# EAGLE board MOSFET_Board (EAGLE 9.2.1)
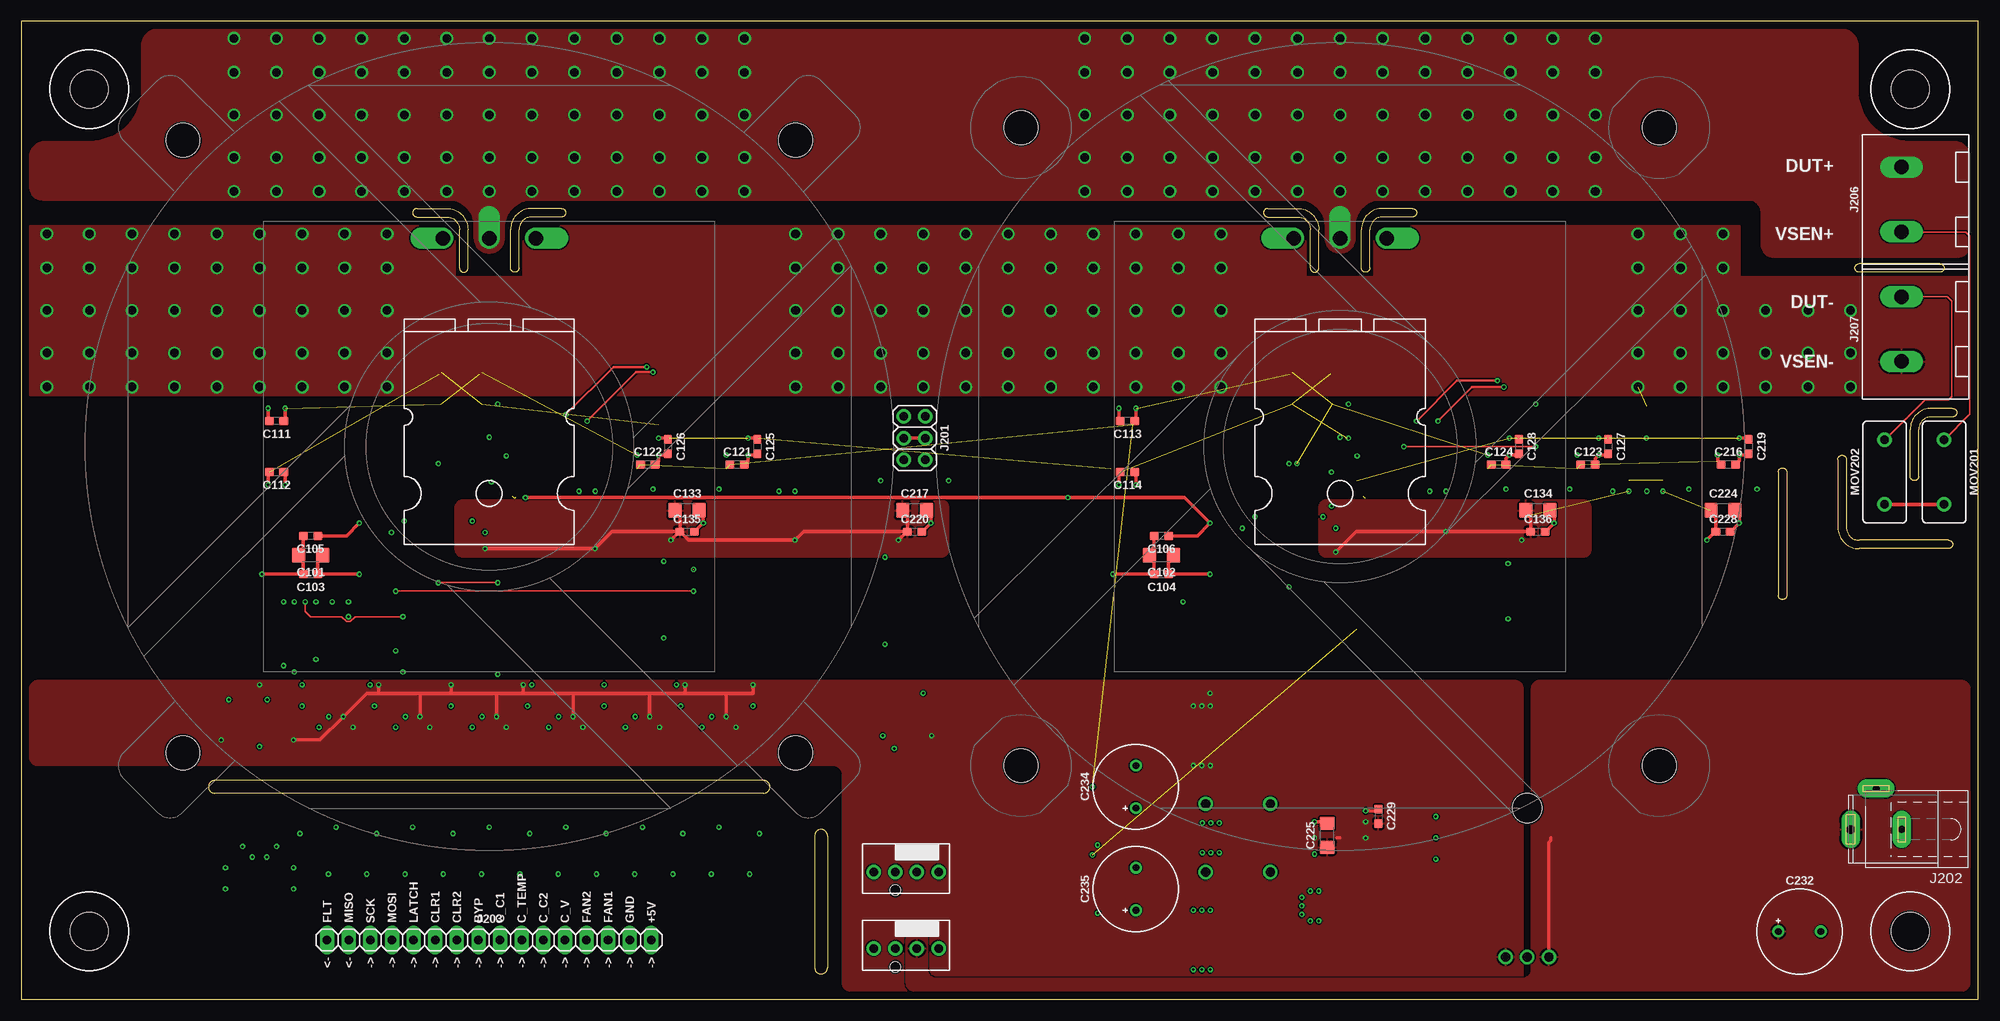
[diagram p3: board, top side]
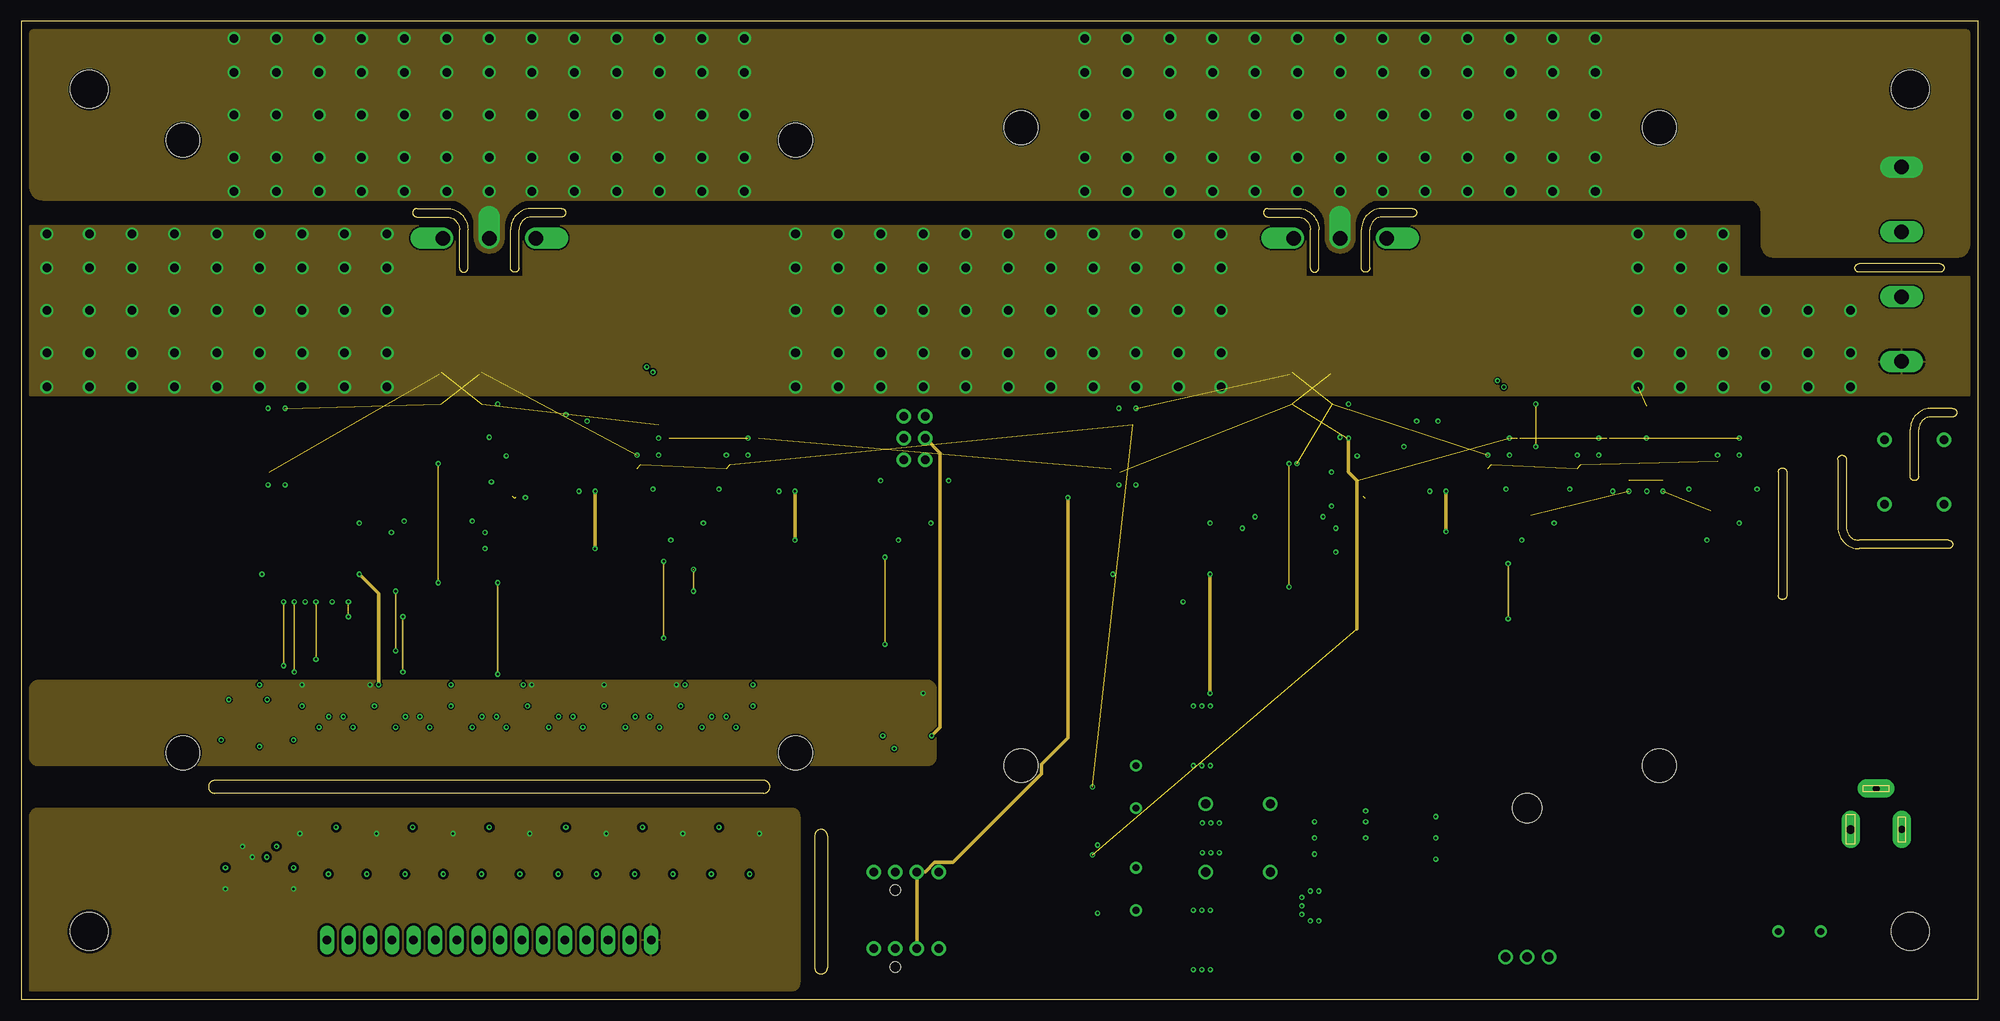
[diagram p4: board, inner layer Route2]
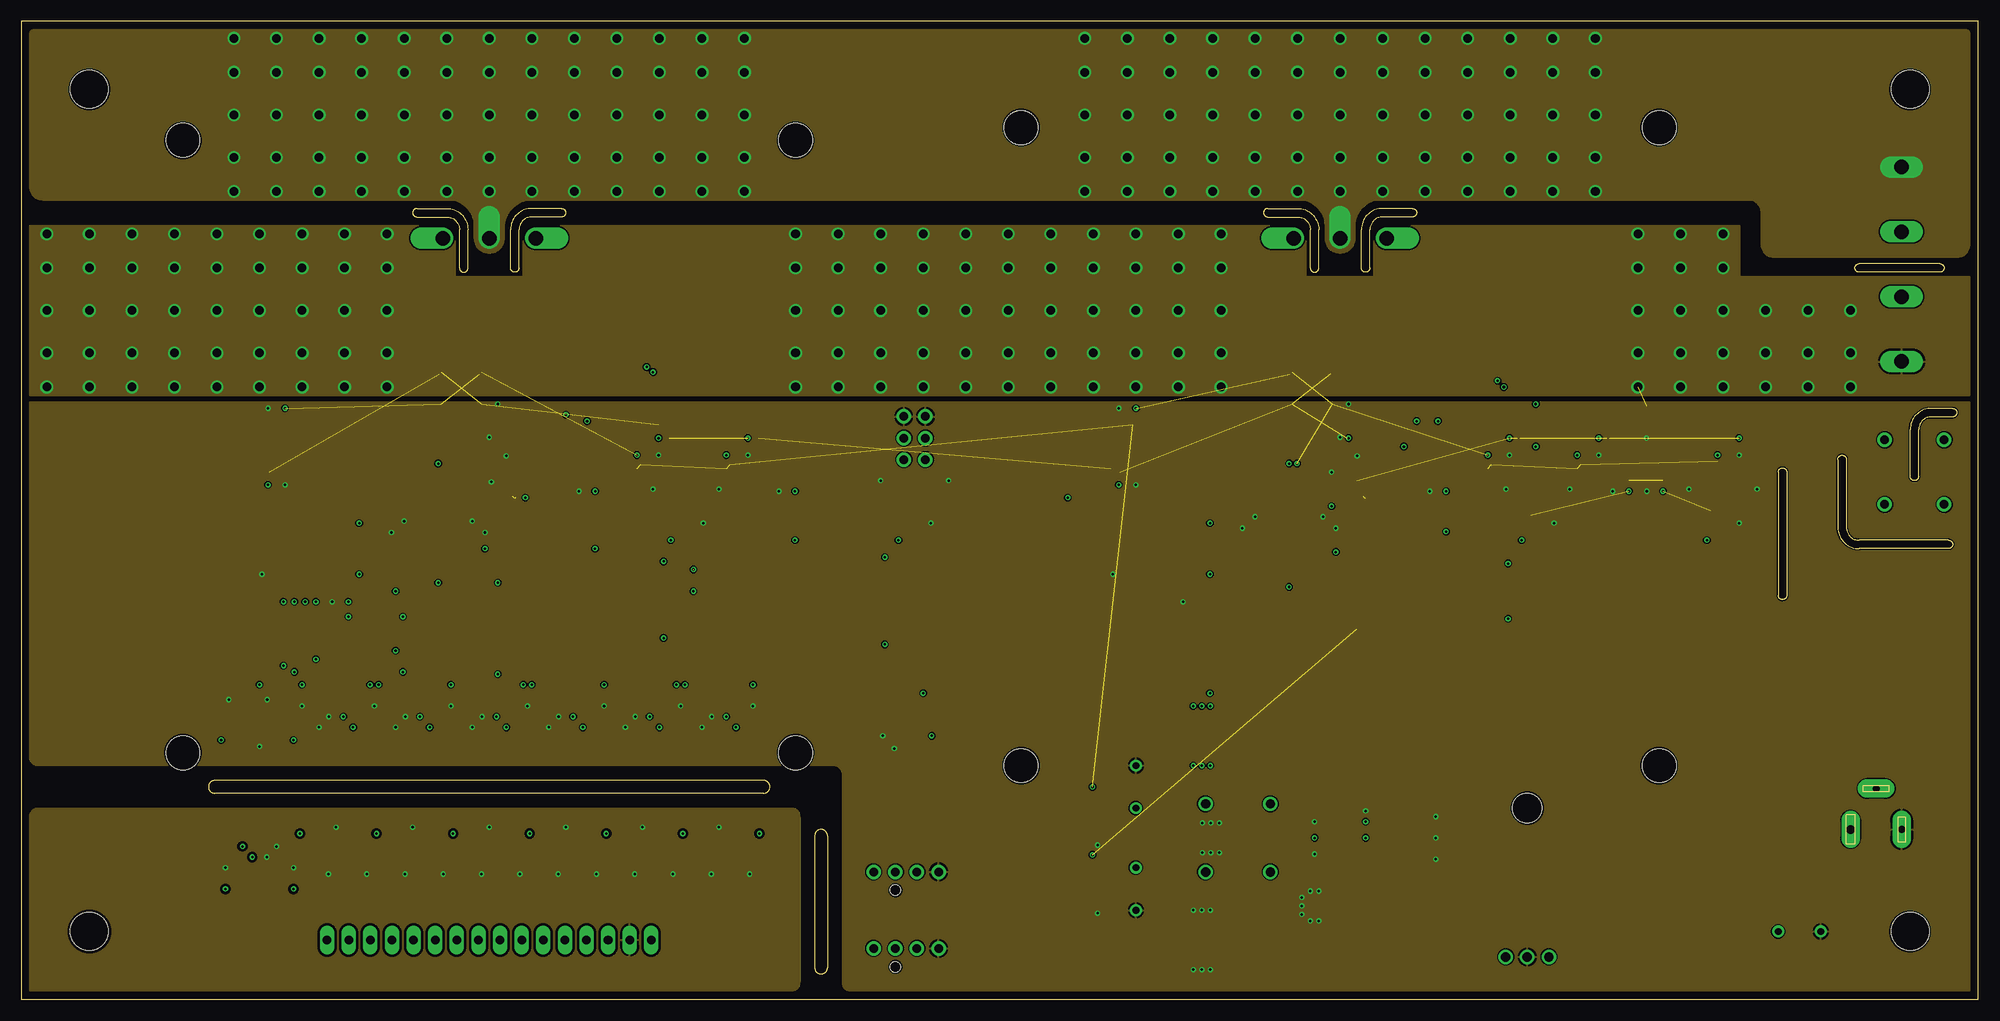
[diagram p5: board, inner layer Route15]
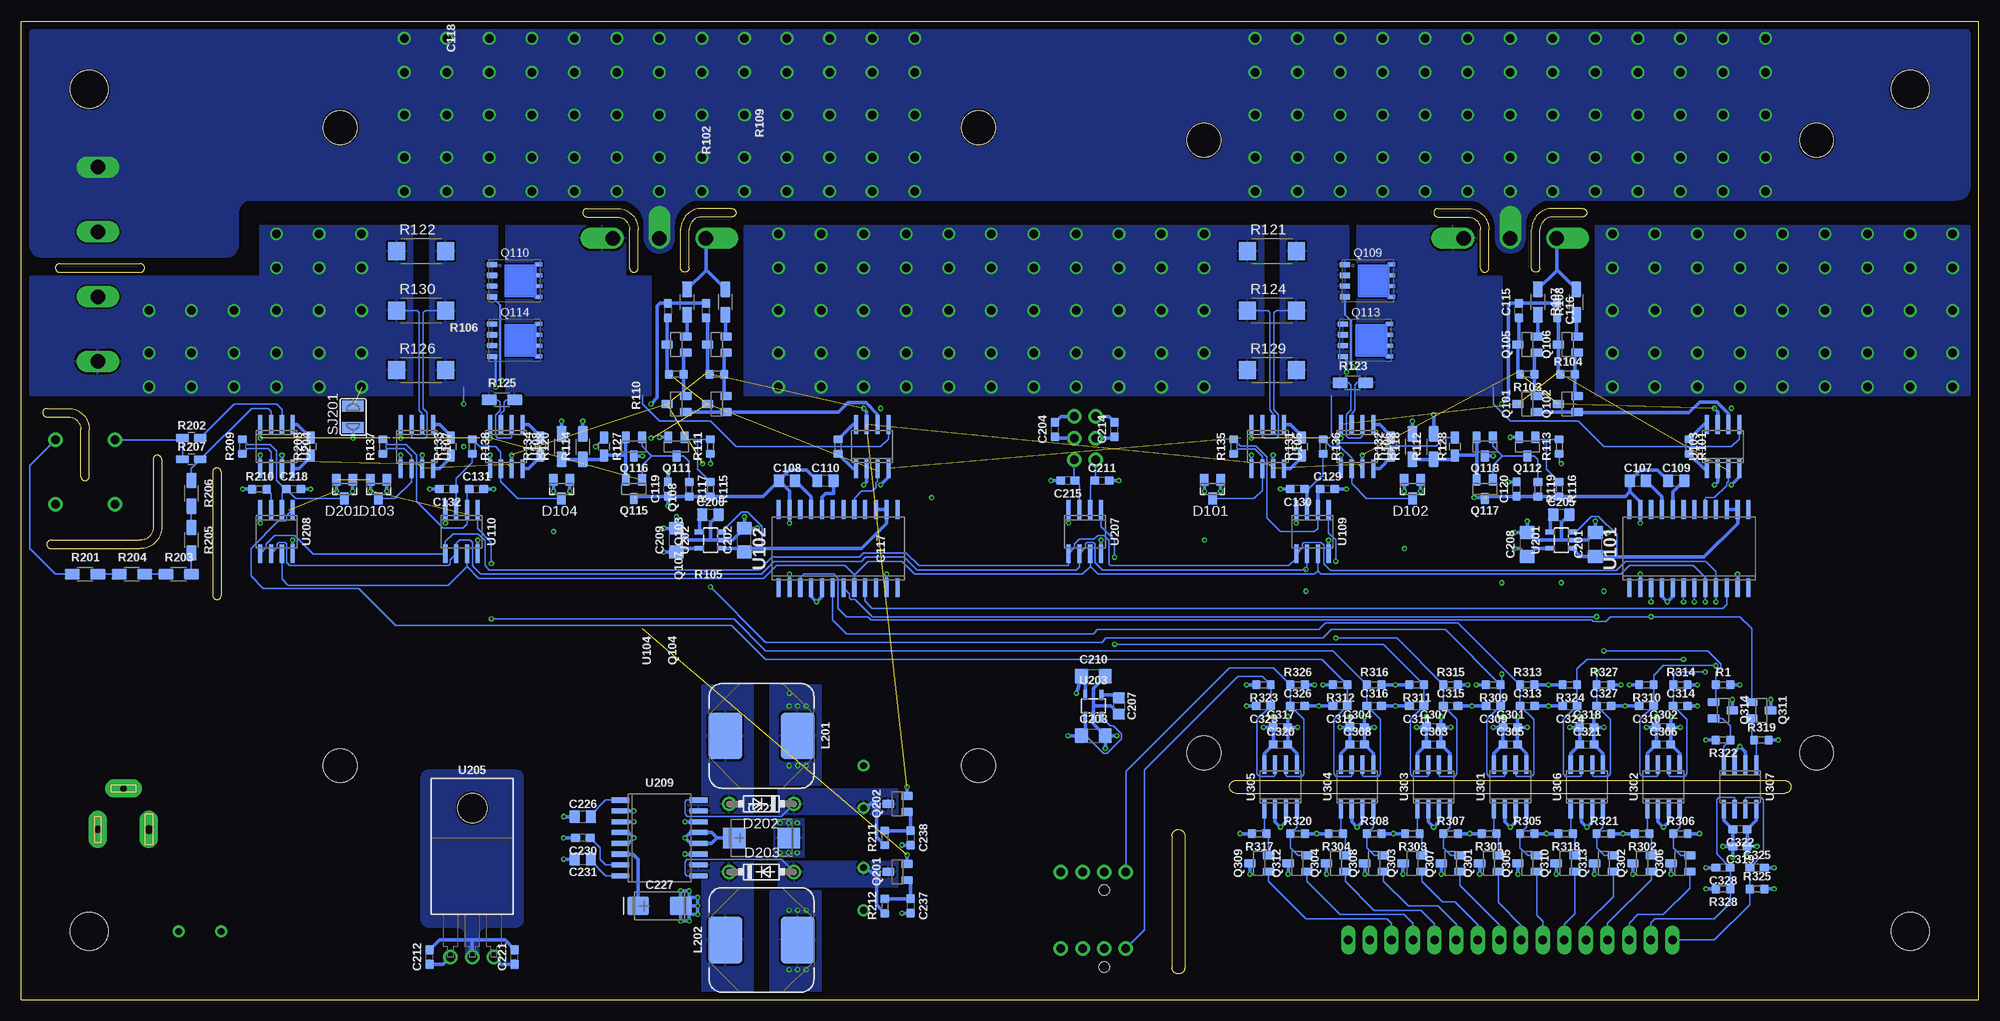
[diagram p6: board, bottom side, seen from below]

Size 230 x 115 mm. Coordinates in mm from the lower left corner, seen from the top.
Outline: 230,115 0,115 0,0 230,0 230,115
Outline: 225.5,85.5 216,85.5 arc-180 216,86.5 225.5,86.5 arc-180 225.5,85.5
Outline: 87.25,25.75 22.75,25.75 arc180 22.75,24.25 87.25,24.25 arc180 87.25,25.75
Outline: 158.5,86 158.5,90.5 arc-90 160,92 163.5,92 arc180 163.5,93 160,93 arc90 157.5,90.5 157.5,86 arc180 158.5,86
Outline: 151.5,86 151.5,90.5 arc90 150,92 146.5,92 arc-180 146.5,93 150,93 arc-90 152.5,90.5 152.5,86 arc-180 151.5,86
Outline: 58.5,86 58.5,90.5 arc-90 60,92 63.5,92 arc180 63.5,93 60,93 arc90 57.5,90.5 57.5,86 arc180 58.5,86
Outline: 51.5,86 51.5,90.5 arc90 50,92 46.5,92 arc-180 46.5,93 50,93 arc-90 52.5,90.5 52.5,86 arc-180 51.5,86
Outline: 94.75,19.25 94.75,3.75 arc-180 93.25,3.75 93.25,19.25 arc-180 94.75,19.25
Outline: 223,61.5 223,67 arc-90 224.5,68.5 227,68.5 arc180 227,69.5 224.5,69.5 arc90 222,67 222,61.5 arc180 223,61.5
Outline: 207.5,62 207.5,47.5 arc-180 206.5,47.5 206.5,62 arc-180 207.5,62
Outline: 226.5,54 216,54 arc-90 214.5,55.5 214.5,63.5 arc180 213.5,63.5 213.5,55.5 arc90 216,53 226.5,53 arc180 226.5,54
Copper layers (1+2*15+16): Top 0.035mm / dielectric 0.18mm / Route2 0.017mm / dielectric 1.12mm / Route15 0.017mm / dielectric 0.18mm / Bottom 0.035mm
Design rules "JLCPCB 4 layers 1oz *": minimum track width 6mil, minimum drill 0.3mm, track to track 6mil, track to pad 6mil, pad to pad 6mil, via to via 6mil, smd to smd 6mil, copper to edge 0.2mm, drill to drill 6mil, minimum pad ring 3mil, minimum via ring 3mil, stop-mask expansion 4mil, vias tented up to drill 0mil, thermal gap 10mil
Net classes: 0 default: drill 0.3 mm; 1 DUT+: drill 0.3 mm, clearance 1.905 mm to class 0; 2 DUT-: drill 0.3 mm, clearance 1.905 mm to class 1; 3 VSENSE+: drill 0.3 mm, clearance 1.905 mm to class 0, clearance 1.905 mm to class 2; 4 VSENSE-: drill 0.3 mm, clearance 1.905 mm to class 1, clearance 1.905 mm to class 3; 5 default_iso: drill 0.3 mm, clearance 1.905 mm to class 0, clearance 1.905 mm to class 1, clearance 1.905 mm to class 2, clearance 1.905 mm to class 3, clearance 1.905 mm to class 4
tRestrict: area 214,99 to 229.8,114.8; area 0.2,99 to 16,114.8

## Footprints (pad centres in the part's own frame; a part is rotated, then mirrored left to right if it is on the bottom)
CAPC3216 = smd 1.6 x 1.8: 1 -1.4,0; 2 1.4,0
CAPC1608 = smd 1.1 x 1: 1 -0.85,0; 2 0.85,0
CAPC2012 = smd 1.3 x 1.5: 1 -0.95,0; 2 0.95,0
CAPCP7343 = smd 2.6 x 2.4: + -3.2,0; - 3.2,0
CAPCP6032 = smd 2.6 x 2.2: + -2.5,0; - 2.5,0
CAPPRD500W60D1000H = drill 0.8 pad 1.4: + -2.5,0; - 2.5,0
SOT23 = smd 1 x 1.4: 1 -0.95,-1.1; 2 0.95,-1.1; 3 0,1.1
DO41-7.6 = drill 1.1 pad 1.7: A 3.81,0; C -3.81,0
D95263-001 = hole 4: -36,36; 36,36; 36,-36; -36,-36
E97378-001 = hole 4: -37.5,37.5; 37.5,37.5; 37.5,-37.5; -37.5,-37.5
HEAD_MALE_2X3 = drill 1 pad 1.7: 1 -2.54,-1.27; 2 -2.54,1.27; 3 0,-1.27; 4 0,1.27; 5 2.54,-1.27; 6 2.54,1.27
SPC4078 = drill 0.8 pad 2.184 long: 1 -3,0; 2 0,-4.8 | drill 1 pad 2.184 long: 3 3,0
HEAD_MALE_1X16 = drill 1 pad 1.7 long: 1 -19.05,0; 2 -16.51,0; 3 -13.97,0; 4 -11.43,0; 5 -8.89,0; 6 -6.35,0; 7 -3.81,0; 8 -1.27,0; 9 1.27,0; 10 3.81,0; 11 6.35,0; 12 8.89,0; 13 11.43,0; 14 13.97,0; 15 16.51,0; 16 19.05,0
MOLEX_47053-1000 = drill 1 pad 1.7: 1 3.81,0; 2 1.27,0; 3 -1.27,0; 4 -3.81,0 | hole 1.25: -1.27,-2.16
AMPHENOL-12-762_2 = drill 1.7 pad 2.4 long: 1 -3.81,0; 2 3.81,0
MSS1260 = smd 5.5 x 4: 1 0,4.25; 2 0,-4.25
DISK_9.5MM = drill 1 pad 1.7: 1 -3.8,0; 2 3.8,0
POWERPAK-SO-8 = smd 1.27 x 0.61: 1 -2.67,1.905; 2 -2.67,0.635; 3 -2.67,-0.635; 4 -2.67,-1.905 | smd 0.6 x 0.3: 5 2.795,1.905; 6 2.795,0.635; 7 2.795,-0.635; 8 2.795,-1.905
TO-264P-H-PADUP = drill 1.7 pad 2.4 offset: 1 -5.46,0; 2 0,0; 3 5.46,0
RESC1608 = smd 1 x 1.1: 1 -0.85,0; 2 0.85,0
RESC3216 = smd 1.8 x 1.2: 1 -1.499,0; 2 1.499,0
RESC6332 = smd 2 x 2.1: 1 -2.896,0; 2 2.896,0
RESC2012 = smd 1.5 x 1: 1 -1.052,0; 2 1.052,0
SJW = smd 1.27 x 2.54: 1 -1.27,0; 2 1.27,0
SO24W = smd 0.6 x 2.2: 1 -6.985,-4.6; 2 -5.715,-4.6; 3 -4.445,-4.6; 4 -3.175,-4.6; 5 -1.905,-4.6; 6 -0.635,-4.6; 7 0.635,-4.6; 8 1.905,-4.6; 9 3.175,-4.6; 10 4.445,-4.6; 11 5.715,-4.6; 12 6.985,-4.6; 13 6.985,4.6; 14 5.715,4.6; 15 4.445,4.6; 16 3.175,4.6; 17 1.905,4.6; 18 0.635,4.6; 19 -0.635,4.6; 20 -1.905,4.6; 21 -3.175,4.6; 22 -4.445,4.6; 23 -5.715,4.6; 24 -6.985,4.6
SO8 = smd 0.6 x 2.2: 1 -1.905,-2.6; 2 -0.635,-2.6; 3 0.635,-2.6; 4 1.905,-2.6; 5 1.905,2.6; 6 0.635,2.6; 7 -0.635,2.6; 8 -1.905,2.6
SOT23-5L = smd 0.55 x 1.2: 1 -0.95,-1.3; 2 0,-1.3; 3 0.95,-1.3; 4 0.95,1.3; 5 -0.95,1.3
TO-220AB-3-BR = drill 1.1 pad 1.7: 1 -2.54,0; 2 0,0; 3 2.54,0 | hole 3.5: 0,17.5
SO16W = smd 0.6 x 2.2: 1 -4.445,-4.6; 2 -3.175,-4.6; 3 -1.905,-4.6; 4 -0.635,-4.6; 5 0.635,-4.6; 6 1.905,-4.6; 7 3.175,-4.6; 8 4.445,-4.6; 9 4.445,4.6; 10 3.175,4.6; 11 1.905,4.6; 12 0.635,4.6; 13 -0.635,4.6; 14 -1.905,4.6; 15 -3.175,4.6; 16 -4.445,4.6
M4 = hole 4.5: 0,0

## Placement (x,y rotation side)
C101  4µ7  [CAPC3216]  34,52.25 180 top
C102  4µ7  [CAPC3216]  134,52.25 180 top
C103  100n  [CAPC1608]  34,50 180 top
C104  100n  [CAPC1608]  134,50 180 top
C105  100n  [CAPC1608]  34,54.5 180 top
C106  100n  [CAPC1608]  134,54.5 180 top
C107  10n  [CAPC2012]  40,61 0 bottom
C108  10n  [CAPC2012]  140,61 0 bottom
C109  10n  [CAPC2012]  35.5,61 0 bottom
C110  10n  [CAPC2012]  135.5,61 0 bottom
C111  100n  [CAPC1608]  30,68 180 top
C112  100n  [CAPC1608]  30,62 180 top
C113  100n  [CAPC1608]  130,68 180 top
C114  100n  [CAPC1608]  130,62 180 top
C115  470n  [CAPC1608]  54,81 90 bottom
C116  470n  [CAPC1608]  49.5,81 270 bottom
C117  470n  [CAPC1608]  149.5,81 90 bottom
C118  470n  [CAPC1608]  154,81 270 bottom
C119  100n  [CAPC1608]  154,60 90 bottom
C120  100n  [CAPC1608]  54.25,60 90 bottom
C121  100n  [CAPC1608]  84.14,62.91 0 top
C122  100n  [CAPC1608]  73.64,62.91 0 top
C123  100n  [CAPC1608]  184.13,62.91 0 top
C124  100n  [CAPC1608]  173.63,62.91 0 top
C125  100n  [CAPC1608]  86.5,65 270 top
C126  100n  [CAPC1608]  76,65 270 top
C127  100n  [CAPC1608]  186.5,65 270 top
C128  100n  [CAPC1608]  176,65 270 top
C129  470p  [CAPC1608]  76.5,60 0 bottom
C130  470p  [CAPC1608]  80,60 180 bottom
C131  470p  [CAPC1608]  176.5,60 0 bottom
C132  470p  [CAPC1608]  180,60 180 bottom
C133  4µ7  [CAPC3216]  78.25,57.5 0 top
C134  4µ7  [CAPC3216]  178.25,57.5 0 top
C135  100n  [CAPC1608]  78.25,55 0 top
C136  100n  [CAPC1608]  178.25,55 0 top
C201  4µ7  [CAPC3216]  45,53.5 90 bottom
C202  4µ7  [CAPC3216]  145,54 90 bottom
C203  4µ7  [CAPC3216]  104,31 0 bottom
C204  100n  [CAPC1608]  108.5,67 90 bottom
C205  10n  [CAPC2012]  49,57 0 bottom
C206  10n  [CAPC2012]  149,57 0 bottom
C207  10n  [CAPC2012]  101,34.5 270 bottom
C208  4µ7  [CAPC3216]  53,53.5 90 bottom
C209  4µ7  [CAPC3216]  153,54 90 bottom
C210  4µ7  [CAPC3216]  104,38 0 bottom
C211  470n  [CAPC1608]  103,61 0 bottom
C212  470n  [CAPC1608]  182,5 90 bottom
C214  100n  [CAPC1608]  101.5,67 90 bottom
C215  470n  [CAPC1608]  107,61 180 bottom
C216  100n  [CAPC1608]  200.63,62.91 0 top
C217  4µ7  [CAPC3216]  105,57.5 0 top
C218  470p  [CAPC1608]  198,60 0 bottom
C219  100n  [CAPC1608]  203,65 270 top
C220  100n  [CAPC1608]  105,55 0 top
C221  100n  [CAPC1608]  172,5 90 bottom
C223  47µ  [CAPCP7343]  143,19 0 bottom
C224  4µ7  [CAPC3216]  200,57.5 0 top
C225  4µ7  [CAPC3216]  153.5,19.29 90 top
C226  10n  [CAPC2012]  164,21.5 0 bottom
C227  10µ  [CAPCP6032]  155,11 0 bottom
C228  100n  [CAPC1608]  200,55 0 top
C229  100n  [CAPC1608]  159.5,21.54 270 top
C230  470n  [CAPC1608]  164,19 180 bottom
C231  10n  [CAPC2012]  164,16.5 180 bottom
C232  220µ  [CAPPRD500W60D1000H]  209,8 0 top
C234  220µ  [CAPPRD500W60D1000H]  131,25 90 top
C235  220µ  [CAPPRD500W60D1000H]  131,13 90 top
C237  470n  [CAPC1608]  125.5,11 270 bottom
C238  470n  [CAPC1608]  125.5,19 270 bottom
C301  100n  [CAPC1608]  55,32 0 bottom
C302  100n  [CAPC1608]  37,32 0 bottom
C303  100n  [CAPC1608]  64,30 0 bottom
C304  100n  [CAPC1608]  73,32 0 bottom
C305  10n  [CAPC1608]  55,30 0 bottom
C306  10n  [CAPC1608]  37,30 0 bottom
C307  10n  [CAPC1608]  64,32 0 bottom
C308  10n  [CAPC1608]  73,30 0 bottom
C309  15p  [CAPC1608]  57,34.5 180 bottom
C310  15p  [CAPC1608]  39,34.5 180 bottom
C311  15p  [CAPC1608]  66,34.5 180 bottom
C312  15p  [CAPC1608]  75,34.5 180 bottom
C313  15p  [CAPC1608]  53,34.5 0 bottom
C314  15p  [CAPC1608]  35,34.5 0 bottom
C315  15p  [CAPC1608]  62,34.5 0 bottom
C316  15p  [CAPC1608]  71,34.5 0 bottom
C317  100n  [CAPC1608]  82,32 0 bottom
C318  100n  [CAPC1608]  46,32 0 bottom
C319  100n  [CAPC1608]  28,18 180 bottom
C320  10n  [CAPC1608]  82,30 0 bottom
C321  10n  [CAPC1608]  46,30 0 bottom
C322  10n  [CAPC1608]  28,20 180 bottom
C323  15p  [CAPC1608]  84,34.5 180 bottom
C324  15p  [CAPC1608]  48,34.5 180 bottom
C325  15p  [CAPC1608]  26,15.5 0 bottom
C326  15p  [CAPC1608]  80,34.5 0 bottom
C327  15p  [CAPC1608]  44,34.5 0 bottom
C328  15p  [CAPC1608]  30,15.5 180 bottom
D101  BAT54S  [SOT23]  90,60 180 bottom
D102  BAT54S  [SOT23]  66.5,60 180 bottom
D103  BAT54S  [SOT23]  188,60 180 bottom
D104  BAT54S  [SOT23]  166.5,60 180 bottom
D201  BAT54S  [SOT23]  192,60 180 bottom
D202  1N5817-B  [DO41-7.6]  143,23 180 bottom
D203  1N5817-B  [DO41-7.6]  143,15 0 bottom
HS101  HEATSINK_LGA775  [D95263-001]  55,65 0 top
HS102  HEATSINK_LGA115X  [E97378-001]  155,65 270 top
J201  TEMP  [HEAD_MALE_2X3]  105,66 270 top
J202  +12V  [SPC4078]  218,20 180 top
J203  CTRL  [HEAD_MALE_1X16]  55,7 0 top
J204  FAN_MOLEX4PIN  [MOLEX_47053-1000]  104,6 0 top
J205  FAN_MOLEX4PIN  [MOLEX_47053-1000]  104,15 0 top
J206  DUT+  [AMPHENOL-12-762_2]  221,94.05 90 top
J207  DUT-  [AMPHENOL-12-762_2]  221,78.81 90 top
L201  100µ  [MSS1260]  143,31 270 bottom
L202  100µ  [MSS1260]  143,7 90 bottom
MOV201  416NR10D  [DISK_9.5MM]  226,62 270 top
MOV202  416NR10D  [DISK_9.5MM]  219,62 90 top
Q101  BC807  [SOT23]  53,70 90 bottom
Q102  BC817  [SOT23]  48.25,70 90 bottom
Q103  BC807  [SOT23]  148.25,70 90 bottom
Q104  BC817  [SOT23]  153,70 90 bottom
Q105  BC817  [SOT23]  53,77 90 bottom
Q106  BC807  [SOT23]  48.25,77 90 bottom
Q107  BC817  [SOT23]  148.25,77 90 bottom
Q108  BC807  [SOT23]  153,77 90 bottom
Q109  SIRC10DP  [POWERPAK-SO-8]  71.75,84.5 0 bottom
Q110  SIRC10DP  [POWERPAK-SO-8]  172,84.5 0 bottom
Q111  BC817  [SOT23]  153,65 180 bottom
Q112  BC817  [SOT23]  53,65 180 bottom
Q113  SIRC10DP  [POWERPAK-SO-8]  72,77.5 0 bottom
Q114  SIRC10DP  [POWERPAK-SO-8]  172,77.5 0 bottom
Q115  BC817  [SOT23]  158,60 180 bottom
Q116  BC807  [SOT23]  158,65 180 bottom
Q117  BC817  [SOT23]  58,60 180 bottom
Q118  BC807  [SOT23]  58,65 180 bottom
Q119  IXTK102N65X2  [TO-264P-H-PADUP]  55,89.5 180 top
Q120  IXTK102N65X2  [TO-264P-H-PADUP]  155,89.5 180 top
Q201  BC817  [SOT23]  127,15 90 bottom
Q202  BC817  [SOT23]  127,23 90 bottom
Q301  BC807  [SOT23]  57.5,16 90 bottom
Q302  BC807  [SOT23]  39.5,16 90 bottom
Q303  BC807  [SOT23]  66.5,16 90 bottom
Q304  BC807  [SOT23]  75.5,16 90 bottom
Q305  BC807  [SOT23]  53,16 90 bottom
Q306  BC807  [SOT23]  35,16 90 bottom
Q307  BC807  [SOT23]  62,16 90 bottom
Q308  BC807  [SOT23]  71,16 90 bottom
Q309  BC807  [SOT23]  84.5,16 90 bottom
Q310  BC807  [SOT23]  48.5,16 90 bottom
Q311  BC807  [SOT23]  25.5,34 270 bottom
Q312  BC807  [SOT23]  80,16 90 bottom
Q313  BC807  [SOT23]  44,16 90 bottom
Q314  BC807  [SOT23]  30,34 270 bottom
R1  1k  [RESC1608]  30,37 0 bottom
R101  49k3  [RESC1608]  34,65 270 bottom
R102  49k3  [RESC1608]  134,65 270 bottom
R103  5k  [RESC1608]  53,73.5 180 bottom
R104  5k  [RESC1608]  48.25,73.5 0 bottom
R105  5k  [RESC1608]  148.25,73.5 180 bottom
R106  5k  [RESC1608]  153,73.5 0 bottom
R107  2R  [RESC3216]  51.75,82 270 bottom
R108  2R  [RESC3216]  47.25,82 90 bottom
R109  2R  [RESC3216]  147.25,82 270 bottom
R110  2R  [RESC3216]  151.75,82 90 bottom
R111  1k  [RESC1608]  149,65 90 bottom
R112  2R  [RESC3216]  64,65 90 bottom
R113  1k  [RESC1608]  49.25,65 90 bottom
R114  2R  [RESC3216]  164,65 90 bottom
R115  100k  [RESC1608]  149,60 270 bottom
R116  100k  [RESC1608]  49.25,60 270 bottom
R117  1k  [RESC1608]  151.5,60 270 bottom
R118  2R  [RESC3216]  66.5,65 90 bottom
R119  1k  [RESC1608]  51.75,60 270 bottom
R120  2R  [RESC3216]  166.5,65 90 bottom
R121  0R01  [RESC6332]  83,88 0 bottom
R122  0R01  [RESC6332]  183,88 0 bottom
R123  2R  [RESC3216]  73.5,72.5 0 bottom
R124  0R01  [RESC6332]  83,81 0 bottom
R125  2R  [RESC3216]  173.5,70.5 0 bottom
R126  0R01  [RESC6332]  183,74 0 bottom
R127  2k15  [RESC2012]  161.5,65 270 bottom
R128  2k15  [RESC2012]  61.5,65 90 bottom
R129  0R01  [RESC6332]  83,74 0 bottom
R130  0R01  [RESC6332]  183,81 0 bottom
R131  2k15  [RESC2012]  79.5,65 90 bottom
R132  2k15  [RESC2012]  69,65 90 bottom
R133  2k15  [RESC2012]  179.5,65 90 bottom
R134  2k15  [RESC2012]  169,65 90 bottom
R135  100R  [RESC1608]  87.5,65 90 bottom
R136  100R  [RESC1608]  77,65 270 bottom
R137  100R  [RESC1608]  187.5,65 90 bottom
R138  100R  [RESC1608]  177,65 270 bottom
R201  2M  [RESC3216]  222.5,50 0 bottom
R202  2k15  [RESC2012]  210,66 0 bottom
R203  2M  [RESC3216]  211.5,50 0 bottom
R204  2M  [RESC3216]  217,50 0 bottom
R205  2M  [RESC3216]  210,54 270 bottom
R206  2M  [RESC3216]  210,59.5 270 bottom
R207  2k15  [RESC2012]  210,63.5 0 bottom
R208  2k15  [RESC2012]  196,65 90 bottom
R209  100R  [RESC1608]  204,65 90 bottom
R210  10k  [RESC1608]  202,60 0 bottom
R211  350R  [RESC1608]  128.5,19 90 bottom
R212  350R  [RESC1608]  128.5,11 90 bottom
R301  350R  [RESC1608]  57.5,19.5 180 bottom
R302  350R  [RESC1608]  39.5,19.5 180 bottom
R303  350R  [RESC1608]  66.5,19.5 180 bottom
R304  350R  [RESC1608]  75.5,19.5 180 bottom
R305  350R  [RESC1608]  53,19.5 0 bottom
R306  350R  [RESC1608]  35,19.5 0 bottom
R307  350R  [RESC1608]  62,19.5 0 bottom
R308  350R  [RESC1608]  71,19.5 0 bottom
R309  350R  [RESC1608]  57,37 180 bottom
R310  1k  [RESC1608]  39,37 180 bottom
R311  1k  [RESC1608]  66,37 180 bottom
R312  1k  [RESC1608]  75,37 180 bottom
R313  350R  [RESC1608]  53,37 0 bottom
R314  1k  [RESC1608]  35,37 0 bottom
R315  1k  [RESC1608]  62,37 0 bottom
R316  1k  [RESC1608]  71,37 0 bottom
R317  350R  [RESC1608]  84.5,19.5 180 bottom
R318  350R  [RESC1608]  48.5,19.5 180 bottom
R319  350R  [RESC1608]  25.5,30.5 0 bottom
R320  350R  [RESC1608]  80,19.5 0 bottom
R321  350R  [RESC1608]  44,19.5 0 bottom
R322  350R  [RESC1608]  30,30.5 180 bottom
R323  350R  [RESC1608]  84,37 180 bottom
R324  350R  [RESC1608]  48,37 180 bottom
R325  350R  [RESC1608]  26,13 0 bottom
R326  350R  [RESC1608]  80,37 0 bottom
R327  350R  [RESC1608]  44,37 0 bottom
R328  350R  [RESC1608]  30,13 180 bottom
SJ201  DUT_GND  [SJW]  191,68.5 90 bottom
U101  AD420  [SO24W]  34,53 0 bottom
U102  AD420  [SO24W]  134,53 0 bottom
U103  AD620  [SO8]  30,65 0 bottom
U104  AD620  [SO8]  130,65 0 bottom
U105  AD620  [SO8]  83.5,65 180 bottom
U106  AD620  [SO8]  73,65 180 bottom
U107  AD620  [SO8]  183.5,65 180 bottom
U108  AD620  [SO8]  173,65 180 bottom
U109  LTC1865L  [SO8]  78.25,55 180 bottom
U110  LTC1865L  [SO8]  178.25,55 180 bottom
U201  LP2985-3.1  [SOT23-5L]  49,54 90 bottom
U202  LP2985-3.1  [SOT23-5L]  149,54 90 bottom
U203  LP2985-3.1  [SOT23-5L]  104,34.5 0 bottom
U204  AD620  [SO8]  200,65 180 bottom
U205  78L05_TO-220AB-3-BR  [TO-220AB-3-BR]  177,5 0 bottom
U207  LTC1865L  [SO8]  105,55 180 bottom
U208  LTC1865L  [SO8]  200,55 180 bottom
U209  MAX743  [SO16W]  155,19 270 bottom
U301  HCPL-063N  [SO8]  55,25 0 bottom
U302  HCPL-063N  [SO8]  37,25 0 bottom
U303  HCPL-063N  [SO8]  64,25 0 bottom
U304  HCPL-063N  [SO8]  73,25 0 bottom
U305  HCPL-063N  [SO8]  82,25 0 bottom
U306  HCPL-063N  [SO8]  46,25 0 bottom
U307  HCPL-063N  [SO8]  28,25 180 bottom
U$6  [M4]  8,107 0 top
U$7  [M4]  222,107 0 top
U$8  [M4]  222,8 0 top
U$9  [M4]  8,8 0 top

## Tracks (layer width: path | path; a pad name or v marks a point on that pad's centre or on a via)
+3V3  (via drill 0.3 pad 0.6)
  Bottom 0.406: R315.2 v60,37 | R312.2 v77,37 | R316.2 v68.5,37 R311.2 | R314.2 v33,37 | v41,37 R310.2 | v106,36 C210.1 104.95,37.55 U203.5
  pour Route2: 2,27.5 arc-90 1,28.5 1,36.5 arc-90 2,37.5 106.5,37.5 arc-90 107.5,36.5 107.5,28.5 arc-90 106.5,27.5
+3V_1  (via drill 0.3 pad 0.6)
  Top 0.406: C220.1 104.09,55 v103.09,54 | C217.1 104.15,56.95 C220.1 | C133.1 77.4,56.95 C135.1 | v54.5,53 v67.44,53 69.44,55 C135.1 | C135.1 78.4,54 v90.94,54 91.94,55 C220.1 | v76.34,54 77.34,55 C135.1
  Route2 0.406: v67.45,59.75 67.45,53.02 v67.44,53 | v90.94,59.75 v90.94,54
  Bottom 0.406: U201.5 52.05,53.05 C208.1 53.9,53 v54.5,53 | v103.09,54 U207.8 | v76.34,54 U109.8 | D102.2 v67.45,59.75 | D101.2 90.95,59.77 v90.94,59.75
  pour Top: 51,53 arc90 52,52 108,52 arc90 109,53 109,57.75 arc90 108,58.75 52,58.75 arc90 51,57.75
+3V_2  (via drill 0.3 pad 0.6)  (3 unrouted)
  Top 0.406: C136.1 177.34,55 | C134.1 177.4,56.95 C136.1 | v198.11,54 199.11,55 C228.1 199.15,56.95 C224.1 | C136.1 v167.45,55 156.9,55 v154.5,52.6
  Route2 0.406: v167.45,59.75 v167.45,55
  Bottom 0.406: v176.34,54 U110.8 | U208.8 198.09,53.99 v198.11,54 | U202.5 152.55,53.05 C209.1 v154.5,52.6 | D104.2 v167.45,59.75 | D103.2 v188.95,59.75 | D201.2 v192.95,59.75
  pour Top: 152.5,53 arc90 153.5,52 183.5,52 arc90 184.5,53 184.5,57.75 arc90 183.5,58.75 153.5,58.75 arc90 152.5,57.75
+5V  (via drill 0.3 pad 0.6)
  Top 0.406: v39.72,50 C103.1 34.85,51.7 C101.1 | 154.61,19 155,19 | v139.72,50 C104.1 134.85,51.7 C102.1 | 42,36 46.85,36 | 46.85,36 50.5,36 | 50.5,36 55.85,36 | 55.85,36 59,36 | 59,36 64.85,36 | 64.85,36 73.85,36 | 73.85,36 78,36 | 78,36 82.85,36 | 82.85,36 86,36 v86,37 | v78,37 78,36 | v82.85,33.25 82.85,36 | v73.85,33.25 73.85,36 | v64.85,33.25 64.85,36 | v59,37 59,36 | v55.85,33.25 55.85,36 | v50.5,37 50.5,36 | v46.85,33.25 46.85,36 | 42,36 40.6,36 v37.85,33.25 35.1,30.5 v32,30.5 | v42,37 42,36 | J201.4 J201.3
  Route2 0.406: v107,31 108,32 108,64.27 J201.4 | v42,37 42,47.72 v39.72,50 | v139.72,50 v139.72,36
  Bottom 0.203: U203.3 102,32.15 101.62,32.15 100.7,31.23 100.7,30.62 102.37,28.95 102.83,28.95 104.88,31 C203.1
  Bottom 0.406: U301.8 56.91,28.95 C305.1 C301.1 | C301.1 v57,32 | v55.85,33.25 C301.1 | R324.2 v50.5,37 R313.2 | R309.2 v59,37 | v86,37 R323.2 | R326.2 v78,37 | v42,37 R327.2 | C302.1 v37.85,33.25 | C302.1 v39,32 | U302.8 38.91,28.95 C306.1 C302.1 | U306.8 47.91,28.95 C321.1 C318.1 | C318.1 v48,32 | C318.1 v46.85,33.25 | U303.8 65.91,28.95 C303.1 C307.1 | C307.1 v66,32 | C307.1 v64.85,33.25 | C304.1 v75,32 | U304.8 74.91,28.95 C308.1 C304.1 | U305.8 83.91,28.95 C320.1 C317.1 | C317.1 v84,32 | C317.1 v82.85,33.25 | R322.2 v32,30.5 | C214.1 101.65,66 J201.3 | C204.1 108.35,66 J201.4 | v39.72,50 U101.2 | U209.3 v158,20.91 | U209.4 158.63,19.63 v158,19 158.63,18.37 U209.5 | C304.1 v73.85,33.25 | v139.72,50 U102.2 | U203.1 104.95,31.45 C203.1 v107,31 | 148.25,19 148.88,19.63 U209.13 151.37,19.63 v152,19 151.37,18.37 U209.12 148.88,18.37 148.25,19 | C223.+ 148.25,19 | C221.1 173.61,4.15 U205.3 | R319.2 v23.5,30.5 | R1.2 v28,37
  other vias: 138.75,34.5 139.75,34.5 137.75,34.5 137.75,27.5 138.75,27.5 139.75,27.5
  pour Bottom: 142,37 142,25.25 136,25.25 136,37
  pour Top (rank 2): 2,27.5 arc-90 1,28.5 1,36.5 arc-90 2,37.5 175.5,37.5 arc-90 176.5,36.5 176.5,2 arc-90 175.5,1 97.5,1 arc-90 96.5,2 96.5,26.5 arc90 95.5,27.5
+5V_I  (via drill 0.3 pad 0.6)
  Bottom 0.406: R306.2 v32.75,19.5 | R302.2 v41.75,19.5 R321.2 | R318.2 v50.75,19.5 R305.2 | R301.2 v59.75,19.5 R307.2 | R303.2 v68.75,19.5 R308.2 | R304.2 v77.75,19.5 R320.2 | R317.2 v86.75,19.5 | U307.8 26.09,21.05 C322.1 C319.1 | v26,18 C319.1 | C319.1 v27.15,16.75 | R325.2 v24,13 | R328.2 v32,13
  pour Route2 (isolate 0.305): 1,1 1,21.5 arc-90 2,22.5 90.5,22.5 arc-90 91.5,21.5 91.5,2 arc-90 90.5,1
+12V  (via drill 0.3 pad 0.6)  (3 unrouted)
  Top 0.406: C105.1 38.22,54.5 v39.72,56 | U205.1 179.54,18.49 179.74,18.69 179.74,19.02 | C106.1 138.22,54.5 v139.72,56 136.72,59 v123,59 v59.25,59
  Route2 0.406: v123,59 123,30.75 119.9,27.65 119.9,26.51 109.5,16.11 107.35,16.11 106.25,15 J205.2 | 105.27,13.02 J205.2 | J204.2 J205.2
  Bottom 0.406: 57.75,59.15 C120.1 R119.2 R116.2 41.5,59.15 40.95,59.7 | 40.95,59.7 C107.1 39.7,62.25 37.7,62.25 C109.1 | 40.95,59.7 39.72,58.47 U101.23 v39.72,56 | v139.72,56 U102.23 139.72,59.77 C108.1 | C110.1 137.7,62.25 139.7,62.25 C108.1 | 157.75,59.15 C119.1 154,59 | 154,59 v154,58 | C108.1 142.8,59.15 R115.2 R117.2 153.85,59.15 154,59 | v59.25,59 58.1,59 | C212.1 180.39,4.15 U205.1
  pour Top: 177.5,3.5 177.5,36.5 arc-90 178.5,37.5 228,37.5 arc-90 229,36.5 229,2 arc-90 228,1 105,1 arc-90 104,2 104,7 arc-90 105,8 105.5,8 arc-90 106.5,7 106.5,3.5 arc90 107.5,2.5 176.5,2.5 arc90
+15V  (via drill 0.3 pad 0.6)  (16 unrouted)
  Top 0.406: C216.1 199.37,63.33 v199.37,64 | C122.1 72.69,63 | C124.1 172.69,63 | C111.1 31,68.15 v31,69.5 | C113.1 131,68.15 v131,69.5
  Bottom 0.406: v182.87,64 U107.7 | v199.37,64 U204.7 | v82.86,64 U105.7 | Q202.2 v125.9,25 | v172.37,64 U108.7 | v72.37,64 U106.7 | C115.1 54,77.1 Q105.3 54.1,73.75 R103.2 | C117.1 149.35,80 Q107.3 149.35,73.75 R105.2 | U103.7 30.64,69.14 v31,69.5 | U104.7 130.63,69.14 v131,69.5
  other vias: 149.95,63
-15V  (via drill 0.3 pad 0.6)  (14 unrouted)
  Top 0.406: 186.35,66 C127.1 186.65,66 | 175,66 v174.91,66 | 175.85,66 C128.1 176.15,66 | C219.1 202.85,66 v201.91,66 | v74.91,66 75.85,66 C126.1 76.15,66 | v85.41,66 86.35,66 C125.1 86.65,66 | v156,66 155.83,66 | C112.2 29,61.85 v29,60.5 | v129,60.5 129,61.85 C114.2
  Route2 0.406: 157,43.57 157,61 156,62 v156,66
  Bottom 0.406: U107.4 v185.41,66 | U108.4 v174.91,66 | U204.4 v201.91,66 | U106.4 v74.91,66 | U105.4 v85.41,66 | Q201.2 v125.9,17 | C116.2 49.35,80 Q106.3 49.35,73.75 R104.1 | C118.2 154.1,80.05 Q108.3 154.1,73.75 R106.1 | v29,60.5 28.09,61.41 U103.4 | U104.4 128.09,61.41 v129,60.5
BPY1G1  (via drill 0.3 pad 0.6)
  Top 0.305: v73.5,74.36 69.6,74.36 v64,68.75
  Bottom 0.305: Q109.4 74.42,80.49 73.73,79.8 73.73,74.59 v73.5,74.36
  Bottom 0.406: v64,68.75 R112.2
BYP  (via drill 0.3 pad 0.6)
  Top 0.203: v49,49 v56,49
  Route2 0.203: v149,63 v149,48.5 | v49,63 v49,49 | v56,49 v56,38.25
  Bottom 0.203: U301.7 55.63,26.37 55.75,26.25 57.5,26.25 57.75,26.5 57.75,32.9 C309.1 R309.1 | R111.1 v149,63 | v149,48.5 142.5,42 103,42 102.5,42.5 77,42.5 76,43.5 62.65,43.5 R309.1 | R113.1 49.25,63.25 v49,63 | v56,38.25 56,37.15 R309.1
BYP1
  Bottom 0.406: R118.1 R112.1 61.95,63.5 R128.1 61.45,64 58.95,64 | Q118.2 58.95,64 | 58.95,64 Q117.2
BYP1G2  (via drill 0.3 pad 0.6)
  Top 0.305: v74.25,73.75 72.25,73.75 v66.5,68
  Bottom 0.305: Q113.4 74.25,75.17 v74.25,73.75
  Bottom 0.406: v66.5,68 R118.2
BYP2
  Bottom 0.406: 158.95,64 Q115.2 | Q116.2 158.95,64 | 158.95,64 161.45,64 R127.2 161.95,63.5 R114.1 R120.1
BYP2G1  (via drill 0.3 pad 0.6)
  Top 0.305: v173.5,72.75 168.75,72.75 v164,68
  Bottom 0.305: Q110.4 173.73,81.66 173.73,72.98 v173.5,72.75
  Bottom 0.406: v164,68 R114.2
BYP2G2  (via drill 0.3 pad 0.6)
  Top 0.305: v174.25,72 170.5,72 v166.5,68
  Bottom 0.305: Q114.4 174.25,75.17 v174.25,72
  Bottom 0.406: v166.5,68 R120.2
BYP_I
  Bottom 0.203: J203.8 53.73,8.73 56.4,11.4 Q301.1
CLR_DAC1  (via drill 0.3 pad 0.6)
  Route2 0.203: v34.64,40 34.64,40.36 v34.64,46.75
  Bottom 0.203: U306.7 46.63,26.37 46.75,26.25 48.5,26.25 48.75,26.5 48.75,32.9 C324.1 R324.1 47.15,38.85 46,40 v34.64,40 | U101.6 v34.64,46.75
CLR_DAC1_I
  Bottom 0.203: J203.6 48.65,8.85 47.4,10.1 Q310.1
CLR_DAC2
  Bottom 0.203: U301.6 54.37,26.37 54.25,26.25 52.5,26.25 52.25,26.5 52.25,32.9 C313.1 R313.1 61.14,44.29 76.71,44.29 77.5,43.5 103.5,43.5 104,43 133,43 134.63,44.64 U102.6
CLR_DAC2_I
  Bottom 0.203: J203.7 51.19,9.19 51.9,9.9 Q305.1
CONV_C1  (via drill 0.3 pad 0.6)
  Route2 0.203: v75.5,51.5 v75.5,42.5
  Bottom 0.203: U303.6 63.37,26.37 63.25,26.25 61.5,26.25 61.25,26.5 61.25,32.9 C315.1 R315.1 68.35,42.5 v75.5,42.5 | U109.1 76.34,54.84 75.5,54 v75.5,51.5
CONV_C1_I
  Bottom 0.203: J203.9 56.27,8.77 60.9,13.4 Q307.1
CONV_C2  (via drill 0.3 pad 0.6)
  Route2 0.203: v174.75,51.25 v174.75,44.75
  Bottom 0.203: U304.6 72.37,26.37 72.25,26.25 70.5,26.25 70.25,26.5 70.25,32.9 C316.1 R316.1 75.85,41 142.5,41 146.25,44.75 v174.75,44.75 | U110.1 176.34,55.34 174.75,53.75 v174.75,51.25
CONV_C2_I
  Bottom 0.203: J203.11 61.35,8.85 63.5,11 67,11 69.9,13.9 Q308.1
CONV_TEMP  (via drill 0.3 pad 0.6)
  Route2 0.203: v101.5,52 v101.5,41.75
  Bottom 0.203: U303.7 64.63,26.37 64.75,26.25 66.5,26.25 66.75,26.5 66.75,32.9 C311.1 R311.1 69.9,41.75 v101.5,41.75 | U207.1 103.09,55.59 101.5,54 v101.5,52
CONV_TEMP_I
  Bottom 0.203: J203.10 58.81,8.81 61.5,11.5 63,11.5 65.4,13.9 Q303.1
CONV_V
  Bottom 0.203: U304.7 73.64,26.37 73.75,26.25 75.5,26.25 75.75,26.5 75.75,32.9 C312.1 R312.1 77.15,40 142.5,40 146.5,44 186,44 190.33,48.34 201.56,48.34 203,49.77 203,53.03 199.78,56.25 199,56.25 198.81,56.43 198.81,56.88 U208.1
CONV_V_I
  Bottom 0.203: J203.12 63.89,8.89 65.5,10.5 71,10.5 74.4,13.9 Q304.1
CSEN_H1
  Bottom 0.203: U106.2 72.37,66.25 72.62,66 74.02,66 74.27,66.25 74.27,68.77 73.75,69.29 73.75,72.25 74,72.5 R123.1 | U105.3 84.14,66.25 83.89,66 82.48,66 82.23,66.25 82.23,68.77 82.75,69.29 82.75,80.75 82.5,81 R124.2 | R128.2 62.66,66.05 63.66,65.05 69.55,65.05 69.94,65.45 75.13,65.45 75.84,66.16 76,66.31 76,71
  pour Bottom: 74,71 82,71 82,91 74,91
CSEN_H2  (via drill 0.3 pad 0.6)
  Top 0.203: v178,65 v162.5,65
  Route2 0.203: v178,70 v178,65
  Bottom 0.203: R125.1 174,70.5 173.75,70.25 173.75,69.25 174.27,68.73 174.27,66.27 174,66 172.5,66 172.37,66.14 U108.2 | R130.2 182.5,81 182.75,80.75 182.75,69.5 182.27,69.02 182.27,66.23 182.5,66 184,66 184.13,66.14 U107.3 | R127.1 161.5,66 v162.5,65 | v178,70 178,72
  pour Bottom: 174,71 182,71 182,91 174,91
CSEN_L1
  Bottom 0.203: U106.3 73.64,68.89 73.25,69.27 73.25,72.25 73,72.5 R123.2 | U103.5 28.09,65.91 29,65 44,65 47,68 55,68 57,70 57,72
  pour Bottom: 73,71 56,71 56,85 59,85 59,91 73,91
CSEN_L2
  Bottom 0.203: R125.2 173,70.5 173.25,70.25 173.25,69.25 173.63,68.86 U108.3 | U104.5 128.09,65.91 129,65 146,65 149,68 155,68 157,70 157,71
  pour Bottom: 173,71 156,71 156,85 159,85 159,91 173,91
DUT+  (via drill 1 pad 1)
  other vias: 30,104 30,109 30,99 30,113 30,95 35,104 35,109 35,99 35,113 35,95 40,104 40,109 40,99 40,113 40,95 45,104 45,109 45,99 45,113 45,95 50,104 50,109 50,99 50,113 50,95 55,104 55,109 55,99 55,113 55,95 25,104 25,109 25,99 25,113 25,95 60,104 60,109 60,99 60,113 60,95 65,104 65,109 65,99 65,113 65,95 70,104 70,109 70,99 70,113 70,95 75,104 75,109 75,99 75,113 75,95 80,104 80,109 80,99 80,113 80,95 85,104 85,109 85,99 85,113 85,95 130,104 130,109 130,99 130,113 130,95 135,104 135,109 135,99 135,113 135,95 140,104 140,109 140,99 140,113 140,95 145,104 145,109 145,99 145,113 145,95 150,104 150,109 150,99 150,113 150,95 155,104 155,109 155,99 155,113 155,95 125,104 125,109 125,99 125,113 125,95 160,104 160,109 160,99 160,113 160,95 165,104 165,109 165,99 165,113 165,95 170,104 170,109 170,99 170,113 170,95 175,104 175,109 175,99 175,113 175,95 180,104 180,109 180,99 180,113 180,95 185,104 185,109 185,99 185,113 185,95
  pour Top (no thermals): 53.25,91 53.25,89.5 arc180 56.75,89.5 56.75,90.75 arc-90 60,94 150.25,94 arc-90 153.25,91 153.25,89.5 arc90 155,87.75 arc90 156.75,89.5 156.75,91 arc-90 159.75,94 203,94 arc-90 204.5,92.5 204.5,88.75 arc90 206,87.25 227.5,87.25 arc90 229,88.75 229,113.5 arc90 228.5,114 1.5,114 arc90 1,113.5 1,95.5 arc90 2.5,94 50.25,94 arc-90
  pour Route2 (no thermals): 53.25,91 53.25,89.5 arc180 56.75,89.5 56.75,90.75 arc-90 60,94 150.25,94 arc-90 153.25,91 153.25,89.5 arc90 155,87.75 arc90 156.75,89.5 156.75,91 arc-90 159.75,94 203,94 arc-90 204.5,92.5 204.5,88.75 arc90 206,87.25 227.5,87.25 arc90 229,88.75 229,113.5 arc90 228.5,114 1.5,114 arc90 1,113.5 1,95.5 arc90 2.5,94 50.25,94 arc-90
  pour Route15 (no thermals): 53.25,91 53.25,89.5 arc180 56.75,89.5 56.75,90.75 arc-90 60,94 150.25,94 arc-90 153.25,91 153.25,89.5 arc90 155,87.75 arc90 156.75,89.5 156.75,91 arc-90 159.75,94 203,94 arc-90 204.5,92.5 204.5,88.75 arc90 206,87.25 227.5,87.25 arc90 229,88.75 229,113.5 arc90 228.5,114 1.5,114 arc90 1,113.5 1,95.5 arc90 2.5,94 50.25,94 arc-90
  pour Bottom (no thermals): 53.25,91 53.25,89.5 arc180 56.75,89.5 56.75,90.75 arc-90 60,94 150.25,94 arc-90 153.25,91 153.25,89.5 arc90 155,87.75 arc90 156.75,89.5 156.75,91 arc-90 159.75,94 203,94 arc-90 204.5,92.5 204.5,88.75 arc90 206,87.25 227.5,87.25 arc90 229,88.75 229,113.5 arc90 228.5,114 1.5,114 arc90 1,113.5 1,95.5 arc90 2.5,94 50.25,94 arc-90
DUT-  (via drill 1 pad 1)  (1 unrouted)
  Bottom 0.203: U105.2 82.86,68.89 83.25,69.27 83.25,80.75 83.5,81 R124.1 | R130.1 183.5,81 183.25,80.75 183.25,69.25 182.87,68.86 U107.2
  other vias: 91,81 91,86 91,76 91,90 91,72 96,81 96,86 96,76 96,90 96,72 101,81 101,86 101,76 101,90 101,72 106,81 106,86 106,76 106,90 106,72 111,81 111,86 111,76 111,90 111,72 116,81 116,86 116,76 116,90 116,72 121,81 121,86 121,76 121,90 121,72 126,81 126,86 126,76 126,90 126,72 131,81 131,86 131,76 131,90 131,72 136,81 136,86 136,76 136,90 136,72 141,81 141,86 141,76 141,90 141,72 190,81 190,86 190,76 190,90 190,72 195,81 195,86 195,76 195,90 195,72 200,81 200,86 200,76 200,90 200,72 205,81 205,76 205,72 210,81 210,76 210,72 215,81 215,76 215,72 3,81 3,86 3,76 3,90 3,72 8,81 8,86 8,76 8,90 8,72 13,81 13,86 13,76 13,90 13,72 18,81 18,86 18,76 18,90 18,72 23,81 23,86 23,76 23,90 23,72 28,81 28,86 28,76 28,90 28,72 33,81 33,86 33,76 33,90 33,72 38,81 38,86 38,76 38,90 38,72 43,81 43,86 43,76 43,90 43,72
  pour Top: 229,85 202,85 202,91 159,91 159,85 151,85 151,91 59,91 59,85 51,85 51,91 1,91 1,71 229,71
  pour Bottom: 84,91 84,71 145,71 145,91
  pour Bottom: 184,91 202,91 202,85 229,85 229,71 184,71
  pour Top: 229,85 202,85 202,91 159,91 159,85 151,85 151,91 59,91 59,85 51,85 51,91 1,91 1,71 229,71
  pour Route15: 229,85 202,85 202,91 159,91 159,85 151,85 151,91 59,91 59,85 51,85 51,91 1,91 1,71 229,71
  pour Route2: 229,85 202,85 202,91 159,91 159,85 151,85 151,91 59,91 59,85 51,85 51,91 1,91 1,71 229,71
  pour Bottom: 1,71 45,71 45,91 1,91
FAN1_PWM
  Bottom 0.203: U305.7 82.64,26.37 82.75,26.25 84.5,26.25 84.75,26.5 84.75,32.9 C323.1 R323.1 84.15,38 87,38 98,27 98,8.19 J204.4
FAN1_PWM_I
  Bottom 0.203: J203.14 68.97,8.97 69.5,9.5 79,9.5 83.4,13.9 Q309.1
FAN2_PWM
  Bottom 0.203: U305.6 81.36,26.37 81.25,26.25 79.5,26.25 79.25,26.5 79.25,32.9 C326.1 R326.1 82.85,39 88,39 100.19,26.81 J205.4
FAN2_PWM_I
  Bottom 0.203: J203.13 66.43,8.93 67.5,10 75,10 78.9,13.9 Q312.1
FLT_DAC  (via drill 0.3 pad 0.6)
  Route2 0.203: v38.44,46.75 v38.44,45
  Bottom 0.203: U101.3 v38.44,46.75 | Q311.1 26.6,43.6 28,45 v38.44,45 43.22,45 43.77,44.45 45.23,44.45 45.43,44.64 130.11,44.64 130.47,45 133,45 134,46 134,49.5 134.5,50 138,50 138.44,49.55 U102.3
FLT_DAC_I
  Bottom 0.203: U307.7 27.36,23.63 27.25,23.75 25.5,23.75 25.25,23.5 25.25,17.1 C325.1 R325.1 26.85,11.15 31,7 J203.1
GND  (via drill 0.3 pad 0.6)
  Top 0.406: C127.2 186.35,64 v185.41,64 184.99,63.58 C123.2 | C124.2 174.49,63.58 v174.91,64 175.85,64 C128.2 | C136.2 179.16,55 v180.16,56 180.16,56.99 C134.2 | v28.28,50 C103.2 33.15,51.7 | 33.15,51.7 C101.2 | C105.2 33.15,51.7 | C220.2 105.91,55 v106.91,56 106.91,56.99 C217.2 | C135.2 79.16,55 v80.16,56 80.16,56.99 C133.2 | C219.2 202.85,64 v201.91,64 201.91,63.33 C216.2 | C228.2 200.91,55 v201.91,56 201.91,56.99 C224.2 | C225.2 153.28,20.91 v152,20.91 | C229.1 159.28,22.17 v158,22.17 | C122.2 74.91,63.33 v74.91,64 75.85,64 C126.2 | C121.2 85.41,63.33 v85.41,64 86.35,64 C125.2 | v128.28,50 C104.2 133.15,51.7 | 133.15,51.7 C102.2 | C106.2 133.15,51.7 | C111.2 29,68.15 v29,69.5 | v31,60.5 31,61.85 C112.1 | C113.2 129,68.15 v129,69.5 | C114.1 131,61.85 v131,60.5
  Bottom 0.406: C129.2 v74.25,60 | v82,60 C130.2 | C201.2 45.9,54 U201.2 49,54 | 49,54 52.1,54 C208.2 | U301.5 53.09,28.95 C305.2 C301.2 | C301.2 v53,32 | v54.15,33.25 C301.2 | C324.2 v50.5,34.5 C313.2 | C309.2 v59.5,34.5 C315.2 | v86,34.5 C323.2 | C312.2 v77.5,34.5 C326.2 | C311.2 v68.5,34.5 C316.2 | C314.2 v33,34.5 | C310.2 v41.5,34.5 C327.2 | C302.2 v35,32 | C302.2 v36.15,33.25 | C302.2 C306.2 35.09,28.95 U302.5 | U306.5 44.09,28.95 C321.2 C318.2 | C318.2 v44,32 | C318.2 v45.15,33.25 | U303.5 62.09,28.95 C303.2 C307.2 | C307.2 v62,32 | C307.2 v63.15,33.25 | U304.5 71.09,28.95 C308.2 C304.2 | C304.2 v71,32 | C304.2 v72.15,33.25 | U305.5 80.09,28.95 C320.2 C317.2 | C317.2 v80,32 | C317.2 v81.15,33.25 | Q314.3 v28.9,35.25 | Q311.3 v24.4,35.25 | U307.2 27.36,29.12 v28,29.75 28.64,29.12 U307.3 | C211.2 v101,61 | v109,61 C215.2 | C214.2 102.19,68.54 J201.1 | C204.2 107.81,68.54 J201.2 | v45,56.25 C201.2 | v185.41,64 U107.5 | v174.91,64 U108.5 | U110.4 v180.16,56 | C131.2 v174.5,60 | v182,60 C132.2 | Q116.3 v157,63.9 | v155,66.1 Q111.2 | v28.28,50 U101.11 | U101.5 35.91,47.39 v36.54,46.75 37.17,47.39 U101.4 | U207.4 v106.91,56 | U109.4 v80.16,56 | v201.91,64 U204.5 | U208.4 v201.91,56 | C231.2 v166.25,16.5 | v126.5,18.15 C238.2 | C237.2 v126.5,10.15 | C221.2 173.15,7 177,7 | C212.2 180.85,7 177,7 | U205.2 177,7 | v53,56.25 C208.2 | C201.2 v43.5,54.9 | v54.5,54.9 C208.2 | C205.2 49,56.05 49,54 | C227.- v152.5,12.75 v151.5,12.75 151.5,12 | C227.- v152.5,9.25 v151.5,9.25 151.5,10 | C227.- v150.5,11 | v150.5,11 v150.5,12 151.5,12 | v150.5,11 v150.5,10 151.5,10 | 151.5,12 C227.- | 151.5,10 C227.- | C226.1 v166.25,21.5 | U209.11 v152,17.09 | U209.14 v152,20.91 | U209.2 v158,22.17 | v74.91,64 U106.5 | v85.41,64 U105.5
  Bottom 0.406: v128.28,50 U102.11 | U102.5 135.91,47.39 v136.54,46.75 137.18,47.39 U102.4 | v154,62 C119.2 | C202.2 146.4,54 U202.2 149,54 | 149,54 151.6,54 C209.2 | C206.2 149,56.05 149,54 | v145,56.75 C202.2 | C202.2 v143.5,55.4 | v153,56.75 C209.2 | v154.5,55.4 C209.2 | D104.1 v165.55,59.75 | D103.1 v187.05,59.75 | D201.1 v191.05,59.75 | C210.2 104,36.6 104,34.5 | 104,34.5 U203.2 104,32.4 C203.2 | C207.2 101.95,34.5 104,34.5 | C203.2 v101.25,31 | v102.6,29.5 C203.2 | Q118.3 v57,63.9 | v55,66.1 Q112.2 | v55.25,60.85 C120.2 | SJ201.1 v191,66 | C230.2 v166.25,19 | D102.1 v65.55,59.75 | D101.1 v89.05,59.75 | C116.1 C115.2 54.9,81.85 55.25,81.5 55.25,70.75 v56,70 | U103.2 30.64,60.87 v31,60.5 | C117.2 C118.1 154.9,81.85 155.25,81.5 155.25,70.75 v156,70 | U104.2 130.63,60.87 v131,60.5 | C218.2 v196,60 | R210.1 v204,60
  other vias: 139.8,20.75 138.8,20.75 140.8,20.75 140.8,17.25 139.8,17.25 138.8,17.25 138.75,10.5 139.75,10.5 137.75,10.5 137.75,3.5 138.75,3.5 139.75,3.5
  pour Route15: 1,28.5 1,70.25 229,70.25 229,1 97.5,1 arc-90 96.5,2 96.5,26.5 arc90 95.5,27.5 2,27.5 arc-90
  pour Bottom: 141.5,21.25 141.5,16.75 138,16.75 138,21.25
  pour Bottom: 142,12.75 142,1 136,1 136,12.75
  pour Bottom (rank 3, no thermals): 176.25,5.75 arc90 177,5 arc90 177.75,5.75 177.75,7.5 arc-90 178.75,8.5 182,8.5 arc90 183,9.5 183,26 arc90 182,27 172,27 arc90 171,26 171,9.5 arc90 172,8.5 175.25,8.5 arc-90 176.25,7.5
GNDI  (via drill 0.3 pad 0.6)
  Bottom 0.406: U302.3 36.36,20.88 v37,20.25 37.64,20.88 U302.2 | U306.3 45.37,20.88 v46,20.25 46.63,20.88 U306.2 | U301.3 54.37,20.88 v55,20.25 55.63,20.88 U301.2 | U303.3 63.37,20.88 v64,20.25 64.63,20.88 U303.2 | U304.3 72.37,20.88 v73,20.25 73.64,20.88 U304.2 | U305.3 81.36,20.88 v82,20.25 82.64,20.88 U305.2 | v85.6,14.75 Q309.3 | v81.1,14.75 Q312.3 | v76.6,14.75 Q304.3 | v72.1,14.75 Q308.3 | v67.6,14.75 Q303.3 | v63.1,14.75 Q307.3 | v58.6,14.75 Q301.3 | v54.1,14.75 Q305.3 | v49.6,14.75 Q310.3 | v45.1,14.75 Q313.3 | v40.6,14.75 Q302.3 | v36.1,14.75 Q306.3 | U307.5 29.91,21.05 C322.2 C319.2 | v28.85,16.75 C319.2 | C319.2 v30,18 | C325.2 v24,15.5 | C328.2 v32,15.5
  pour Route15 (isolate 0.305): 1,1 1,21.5 arc-90 2,22.5 90.5,22.5 arc-90 91.5,21.5 91.5,2 arc-90 90.5,1
HIGHC1
  Bottom 0.203: R135.2 86.73,65.08 84.86,65.08 83.58,63.8 83.58,56.58 82,55 78,55 77.61,55.38 U109.2
  Bottom 0.406: U109.2 77.61,59.73 C129.1
HIGHC2
  Bottom 0.203: C131.1 177.62,59.73 U110.2 177.62,55.88 178.05,55.45 180.43,55.45 183.53,58.55 183.53,64.03 184.75,65.25 186.9,65.25 R137.2
LATCH_DAC  (via drill 0.3 pad 0.6)
  Top 0.203: v44.85,45 39.23,45 38.67,44.45 38.22,44.45 37.66,45 34,45 33.36,45.64 v33.36,46.75
  Route2 0.203: v44.85,45 v44.85,38.5
  Bottom 0.203: U306.6 45.37,26.37 45.25,26.25 43.5,26.25 43.25,26.5 43.25,32.9 C327.1 R327.1 v44.85,38.5 | U101.7 v33.36,46.75 | v44.85,45 129.97,45 132.01,47.05 132.47,47.05 132.65,47.23 132.65,47.68 U102.7
LATCH_DAC_I
  Bottom 0.203: J203.5 46.11,8.89 42.9,12.1 Q313.1
LGATE_1
  Bottom 0.406: R108.2 49.54,85.79 | 49.54,85.79 Q119.3 | R107.1 49.54,85.71 49.54,85.79
LGATE_2
  Bottom 0.406: R109.1 149.54,85.79 | 149.54,85.79 Q120.3 | R110.2 149.54,85.71 149.54,85.79
LOWC1
  Bottom 0.203: R136.2 77,61.5 77.25,61.5 78.75,60 C130.1
  Bottom 0.406: U109.3 78.89,59.73 C130.1
LOWC2
  Bottom 0.203: C132.1 178.88,59.73 | 178.88,59.73 U110.3 | 178.88,59.73 178.88,61.27 177,63.15 R138.2
MISO  (via drill 0.3 pad 0.6)  (1 unrouted)
  Top 0.203: v44,48 v79,48
  Route2 0.203: v44,41 v44,48 | v79,48 v79,50.55
  Bottom 0.203: U109.6 78.89,50.62 79,50.5 102.92,50.5 103.81,51.39 103.81,53.57 104,53.75 104.73,53.75 104.92,53.57 104.92,53.12 U207.6 105.64,50.87 106,50.5 124.74,50.5 126.24,52 130.75,52 131.25,51.5 141.5,51.5 143,50 176,50 176.98,50.98 176.98,53.73 177.25,54 178.5,54 178.88,53.62 U110.6 179.6,51.68 179.6,51.23 179.78,51.05 198.47,51.05 198.81,51.39 198.81,53.57 199,53.75 199.74,53.75 199.92,53.57 199.92,53.12 U208.6 | Q314.1 30.85,35.2 R1.1 30.85,38.44 30.27,39.02 30.27,39.48 31.79,41 v44,41
MISO_I
  Bottom 0.203: U307.6 28.64,23.63 28.75,23.75 30.5,23.75 30.75,23.5 30.75,17.1 C328.1 R328.1 29.15,11.35 31,9.5 38,9.5 38.49,9.01 J203.2
MOSI  (via drill 0.3 pad 0.6)
  Route2 0.203: v30.83,39.25 v30.83,46.75
  Bottom 0.203: U302.7 37.64,26.37 37.75,26.25 39.5,26.25 39.75,26.5 39.75,32.9 C310.1 R310.1 38.15,38.1 37,39.25 v30.83,39.25 | v30.83,46.75 U101.9 30.83,50.33 32,51.5 41.5,51.5 42.55,50.45 76.11,50.45 76.9,51.23 76.9,53.41 77.25,53.75 79.25,53.75 79.44,53.57 79.44,53.12 U109.5 80.16,51.84 81,51 102,51 102.19,51.19 102.19,53.97 102.77,54.55 103.48,54.55 103.92,54.11 105.65,54.11 106.19,53.57 106.19,53.12 U207.5 106.91,51.09 107,51 124.5,51 126,52.5 131,52.5 131.5,52 141.75,52 143.25,50.5 175,50.5 175.5,51 175.5,53.94 176.31,54.75 179.25,54.75 180.16,53.84 U110.5 195.72,52.4 197.88,54.55 200.2,54.55 201.19,53.57 201.19,53.12 U208.5
MOSI_I
  Bottom 0.203: J203.4 43.57,8.93 38.4,14.1 Q302.1
N$1
  Bottom 0.406: Q105.1 52.15,75.8 R103.1 52.15,71.2 Q101.2
N$2
  Bottom 0.406: U103.1 32.25,62.4 R101.2
N$3
  Bottom 0.406: U101.21 37.17,59.12 C107.2
N$4
  Bottom 0.406: C109.2 35.91,59.64 U101.20
N$5
  Bottom 0.203: 55.9,63.9 Q112.3 52.15,63.9 51.75,63.5 R119.1 | Q118.1 57.05,65.05 55.9,63.9 | Q117.1 57.05,62.75 55.9,63.9
N$6
  Bottom 0.406: U103.8 32.25,67.6 R101.1
N$7
  Bottom 0.203: R135.1 86.92,64.72 85.01,64.72 84.14,63.85 U105.6 84.14,59.87 85.1,58.9 D101.3
N$8
  Bottom 0.203: 50.75,65.85 R113.2 | 50.75,65.85 51.8,65.85 Q112.1 | R116.1 50.75,62.35 50.75,65.85
N$9
  Bottom 0.203: U101.17 32.09,58.91 32,59 31,59 29.55,60.45 29.55,60.73 29.36,60.92 U103.3
N$10
  Bottom 0.406: C205.1 50.3,56.65 U201.4
N$11
  Bottom 0.406: Q106.2 47.25,78.05 R108.1
N$12
  Bottom 0.406: Q103.2 147.4,71.2 R105.1 147.4,75.8 Q107.1
N$13
  Bottom 0.406: Q105.2 51.75,78.1 R107.2
N$14
  Bottom 0.406: Q108.2 151.75,78.1 R110.1
N$15
  Bottom 0.406: Q107.2 147.25,78.05 R109.2
N$16
  Bottom 0.203: R136.1 76.15,65 75,65 73.64,63.63 U106.6 73.64,60.63 71.9,58.9 D102.3
N$17
  Bottom 0.203: U307.1 26.09,30.24 R319.1 26.6,30.75 Q311.2
N$18
  Bottom 0.203: U307.4 29.91,29.74 R322.1 29.15,32.15 30.05,33.05 Q314.2
N$19
  Bottom 0.203: U304.1 74.91,19.76 R304.1 74.4,19.25 Q304.2
N$20
  Bottom 0.203: U304.4 71.09,20.26 R308.1 71.85,17.85 70.95,16.95 Q308.2
N$21
  Bottom 0.203: U302.1 38.91,19.76 R302.1 38.4,19.25 Q302.2
N$22
  Bottom 0.203: U302.4 35.09,20.26 R306.1 35.85,17.85 34.95,16.95 Q306.2
N$23
  Bottom 0.203: U204.6 200.63,64.39 201,64.75 203.4,64.75 R209.1
N$24
  Bottom 0.203: R206.2 R205.1
N$25
  Bottom 0.203: Q116.1 157.05,65.05 155.9,63.9 | 155.9,63.9 Q111.3 152.15,63.9 151.5,63.25 R117.1 | Q115.1 157.05,62.75 155.9,63.9
N$26
  Bottom 0.203: R205.2 R203.2
N$27
  Bottom 0.203: R203.1 R204.2
N$28
  Top 0.406: MOV202.1 MOV201.2
N$29
  Bottom 0.203: R206.1 210,62.45 R207.2 202.95,69.5 201,69.5 200.63,69.14 U204.3
N$30
  Bottom 0.203: R209.2 203.4,65.25 200.75,65.25 200,64.5 200,61 198.93,59.92 | U208.2 199.37,59.48 198.93,59.92 | 198.93,59.92 C218.1 197.8,58.95 197.72,58.95 197.67,58.9 D201.3
N$31
  Bottom 0.203: 150.5,65.85 R111.2 | 150.5,65.85 151.8,65.85 Q111.1 | R115.1 150.5,62.35 150.5,65.85
N$32
  Bottom 0.203: U209.16 151.81,23.45 152,23.25 152,21.8 151.74,21.54 140.65,21.54 D202.C
  Bottom 0.406: R211.1 129.5,19.15 129.5,23 129.72,23.22 C234.+
  pour Bottom: 141,24.75 141,21.75 127,21.75 127,24.75
N$33
  Bottom 0.203: R204.1 R201.2
N$34
  Bottom 0.203: U209.8 161.31,14.55 163.05,16.3 C231.1
N$35
  Bottom 0.203: U209.7 161.32,15.83 162,16.5 162,17.85 C230.1
N$36
  Bottom 0.203: U204.2 199.37,69.36 200,70 204.95,70 R202.2
N$37
  Bottom 0.203: U209.1 161.31,23.45 163.05,21.7 C226.2
N$38
  pour Bottom: 150,37 150,23 152,23 152,21 144,21 144,37
N$39
  pour Bottom: 150,1 150,15 152,15 152,17 144,17 144,1
N$40
  Bottom 0.203: U305.1 83.91,19.76 R317.1 83.4,19.25 Q309.2
N$41
  Bottom 0.406: C108.2 137.18,59.12 U102.21
N$42
  Bottom 0.406: C110.2 134.55,59.5 135.5,59.5 135.91,59.09 U102.20
N$43
  Bottom 0.406: Q104.1 Q103.1 133.95,69.05 132.84,70.16 130.73,70.16 129.37,68.79 U104.6
N$44
  Bottom 0.406: Q104.2 152.15,71.2 R106.2 152.15,75.8 Q108.1
N$45
  Bottom 0.203: U208.3 200.63,59.48 R210.2
N$46
  Bottom 0.203: U305.4 80.09,20.26 R320.1 80.85,17.85 79.95,16.95 Q312.2
N$47
  Bottom 0.203: U301.1 56.91,19.76 R301.1 56.4,19.25 Q301.2
N$48
  Bottom 0.203: U301.4 53.09,20.26 R305.1 53.85,17.85 52.95,16.95 Q305.2
N$49
  Bottom 0.406: U104.1 132.25,62.4 R102.2
N$50
  Bottom 0.406: U104.8 132.25,67.6 R102.1
N$51
  Bottom 0.203: U102.17 132.09,58.91 131.25,59.75 130,59.75 129.55,60.2 129.55,60.73 129.37,60.92 U104.3
N$56
  Bottom 0.203: R137.1 186.9,64.75 185,64.75 184.13,63.88 U107.6 184.13,60.87 186.1,58.9 D103.3
N$57
  Bottom 0.203: R138.1 176.15,65 174.25,65 173.63,64.39 U108.6 173.63,60.88 171.65,58.9 D104.3
N$58
  Bottom 0.203: U306.1 47.91,19.76 R318.1 47.4,19.25 Q310.2
N$59
  Bottom 0.203: U306.4 44.09,20.26 R321.1 44.85,17.85 43.95,16.95 Q313.2
N$62
  Bottom 0.406: U202.4 150.3,56.65 C206.1
N$63
  Bottom 0.406: R211.2 C238.1 125.5,21.65 Q202.1
N$64
  Bottom 0.203: U209.9 151.81,14.55 152,14.75 152,16.2 151.74,16.46 140.65,16.46 D203.A
  Bottom 0.406: R212.1 129.5,11.15 129.5,15 129.72,14.78 C235.-
  pour Bottom: 141,16.25 141,13.25 127,13.25 127,16.25
N$65
  Bottom 0.406: Q201.1 125.5,13.65 C237.1 R212.2
N$66
  Bottom 0.406: C207.1 101.35,35.8 U203.4
N$67
  Bottom 0.406: Q101.1 Q102.1 47.1,69 34,69 32.75,70.25 30.75,70.25 29.36,68.86 U103.6
N$68
  Bottom 0.406: Q102.2 47.4,71.2 R104.2 47.4,75.8 Q106.1
N$76
  Bottom 0.203: U303.1 65.91,19.76 | 65.91,19.76 R303.1 | Q303.2 65.4,19.25 65.91,19.76
N$77
  Bottom 0.203: U303.4 62.09,20.26 R307.1 62.85,17.85 61.95,16.95 Q307.2
RG1_H6
  Bottom 0.406: U204.1 197.55,67.6 R208.2
RG1_L1
  Bottom 0.406: U107.1 180.85,67.6 179.5,66.25 R133.2
RG1_L2
  Bottom 0.406: U108.1 170.35,67.6 169.25,66.5 169.25,66.3 R134.2
RG1_L3
  Bottom 0.406: U105.1 80.85,67.6 79.5,66.25 R131.2
RG1_L4
  Bottom 0.406: U106.1 70.35,67.6 69.25,66.5 69.25,66.3 R132.2
RG2_H6
  Bottom 0.406: U204.8 197.35,62.4 196,63.75 R208.1
RG2_L1
  Bottom 0.406: U107.8 180.85,62.4 179.5,63.75 R133.1
RG2_L2
  Bottom 0.406: U108.8 170.35,62.4 169,63.75 R134.1
RG2_L3
  Bottom 0.406: U105.8 80.85,62.4 79.5,63.75 R131.1
RG2_L4
  Bottom 0.406: U106.8 70.35,62.4 69,63.75 R132.1
SCK  (via drill 0.3 pad 0.6)
  Route2 0.203: v32.09,38.5 v32.09,46.75
  Bottom 0.203: 177.62,50.88 176.23,49.5 142.75,49.5 141.25,51 133.19,51 132.09,49.91 | 77.61,50.38 78,50 103.48,50 104.36,50.88 | U109.7 77.61,50.38 | 77.61,50.38 77.23,50 42,50 41,51 33.5,51 32.09,49.59 U101.8 v32.09,46.75 | U302.6 36.36,26.37 36.25,26.25 34.5,26.25 34.25,26.5 34.25,32.9 C314.1 R314.1 35.85,38.15 35.5,38.5 v32.09,38.5 | U110.7 177.62,50.88 | U207.7 104.36,50.88 | 104.36,50.88 105.25,50 124.99,50 126.49,51.5 130.5,51.5 132.09,49.91 | 132.09,49.91 U102.8 | 177.62,50.88 179.81,48.69 198.61,48.69 199.37,49.44 U208.7
SCK_I
  Bottom 0.203: J203.3 41.03,8.97 40,10 37,10 33.9,13.1 Q306.1
SDO_DAC1
  Bottom 0.203: U101.10 29.56,46.45 30,46 130,46 130.82,46.83 U102.9
TEMP1
  Bottom 0.203: J201.5 103.73,61.12 C211.1 104.36,60.48 U207.2
TEMP2
  Bottom 0.203: U207.3 105.64,60.48 C215.1 106.27,61.12 J201.6
VREF1
  Bottom 0.203: U201.3 47.3,54.95 45.45,56.8 44.62,56.8 42.5,54.68 42.5,52
  Bottom 0.406: U101.15 U101.14 28.28,55.97 32.25,52 42.5,52 44.9,52 C201.1 46.75,52.1 U201.1
VREF2
  Bottom 0.203: U202.3 145.35,57.3 144.62,57.3 142.95,55.63 142.95,53.05 143,53
  Bottom 0.406: U102.15 U102.14 128.28,55.97 131.25,53 143,53 144.6,53 C202.1 145.45,53.05 U202.1
VREF_MAX743
  Bottom 0.406: C227.+ 157.5,16.5 158.09,17.09 U209.6
VSENSE+
  Top 0.203: MOV201.1 229,68.8 229,89.75 228.51,90.24 J206.1
  Bottom 0.203: R201.1 226,50 229,53 229,62.8 MOV201.1
VSENSE-
  Top 0.203: J207.2 226.38,82.62 226.89,82.11 226.89,70.89 226.5,70.5 223.7,70.5 MOV202.2
  Bottom 0.203: R207.1 R202.1 211.25,65.8 MOV202.2

## Text on the board
tPlace: DUT+ | VSEN+ | DUT- | VSEN- | FLT | MISO | SCK | MOSI | LATCH | CLR1 | CLR2 | BYP | C_C1 | C_TEMP | C_C2 | C_V | FAN2 | FAN1 | GND | +5V | <- | <- | -> | -> | -> | -> | -> | -> | -> | -> | -> | -> | -> | -> | -> | ->